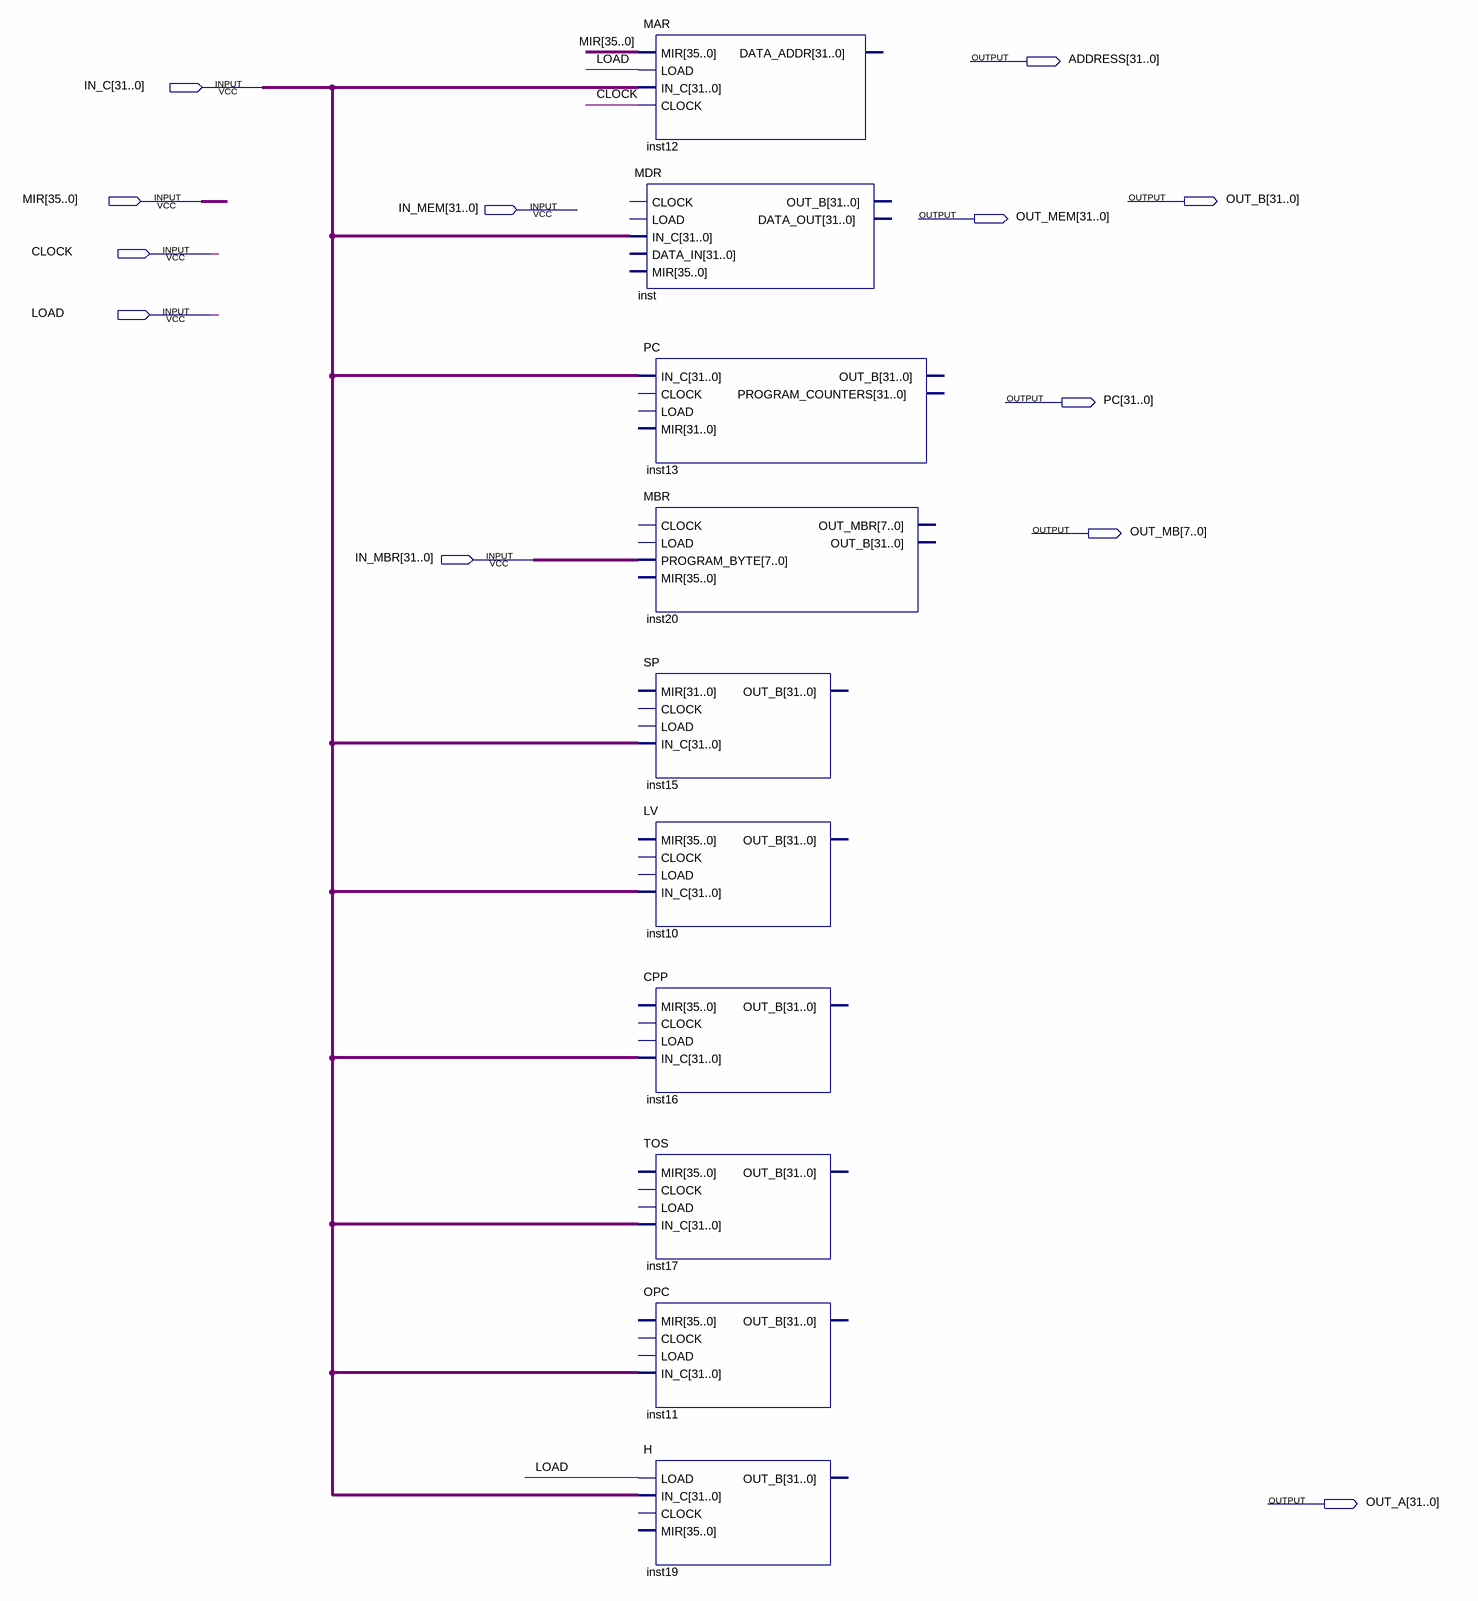
[diagram p0: schematic sheet]
// Quartus schematic REGISTER_BANK.bdf as structural Verilog: 10 symbols, 12 pins
module REGISTER_BANK (
  input  [31:0] IN_C,
  input  [35:0] MIR,
  input  [31:0] IN_MEM,
  input  CLOCK,
  input  LOAD,
  input  [31:0] IN_MBR,
  output [31:0] ADDRESS,
  output [31:0] OUT_B,
  output [31:0] OUT_MEM,
  output [31:0] PC,
  output [7:0] OUT_MB,
  output [31:0] OUT_A
);

  MAR inst12 (.MIR(MIR), .LOAD(LOAD), .IN_C(IN_C), .CLOCK(CLOCK));  // open: DATA_ADDR
  MDR inst (.IN_C(IN_C));  // open: CLOCK, LOAD, DATA_IN, MIR, OUT_B, DATA_OUT
  PC inst13 (.IN_C(IN_C));  // open: CLOCK, LOAD, MIR, OUT_B, PROGRAM_COUNTERS
  MBR inst20 (.PROGRAM_BYTE(IN_MBR));  // open: CLOCK, LOAD, MIR, OUT_MBR, OUT_B
  SP inst15 (.IN_C(IN_C));  // open: MIR, CLOCK, LOAD, OUT_B
  LV inst10 (.IN_C(IN_C));  // open: MIR, CLOCK, LOAD, OUT_B
  CPP inst16 (.IN_C(IN_C));  // open: MIR, CLOCK, LOAD, OUT_B
  TOS inst17 (.IN_C(IN_C));  // open: MIR, CLOCK, LOAD, OUT_B
  OPC inst11 (.IN_C(IN_C));  // open: MIR, CLOCK, LOAD, OUT_B
  H inst19 (.LOAD(LOAD), .IN_C(IN_C));  // open: CLOCK, MIR, OUT_B
endmodule
